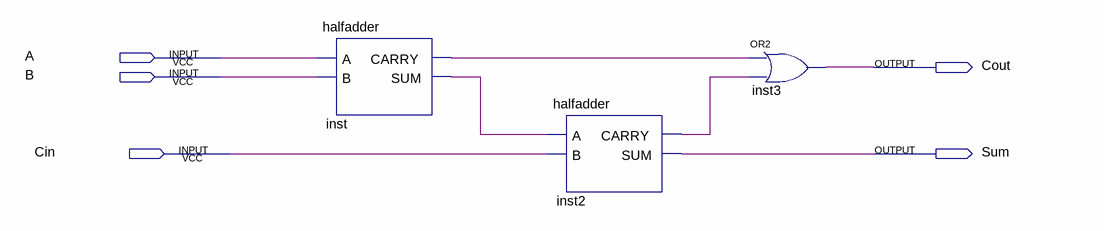
[diagram p0: schematic sheet]
// Quartus schematic fulladder.bdf as structural Verilog: 3 symbols, 5 pins
module fulladder (
  input  A,
  input  B,
  input  Cin,
  output Cout,
  output Sum
);

  wire inst2_carry, inst_carry, inst_sum;

  halfadder inst (.A(A), .B(B), .CARRY(inst_carry), .SUM(inst_sum));
  halfadder inst2 (.A(inst_sum), .B(Cin), .CARRY(inst2_carry), .SUM(Sum));
  or inst3 (Cout, inst_carry, inst2_carry);
endmodule
